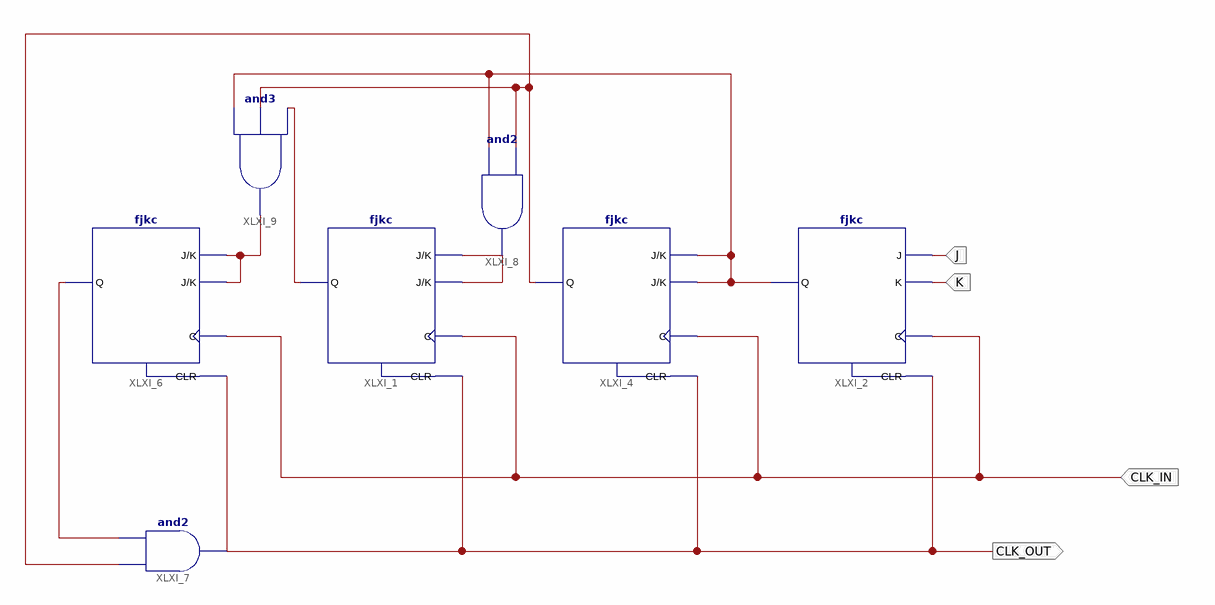
[diagram p0: schematic sheet 1]
// Xilinx ISE schematic Mod10Pulse.sch (spartan6) as structural Verilog: 7 symbols, 4 ports
module Mod10Pulse (
  input  K,
  input  J,
  input  CLK_IN,
  output CLK_OUT
);

  wire XLXN_13, XLXN_14, XLXN_18, XLXN_20, XLXN_23, XLXN_26;

  and XLXI_9 (XLXN_20, XLXN_18, XLXN_23, XLXN_26);
  and XLXI_8 (XLXN_13, XLXN_18, XLXN_23);
  and XLXI_7 (CLK_OUT, XLXN_23, XLXN_14);
  fjkc XLXI_4 (.C(CLK_IN), .CLR(CLK_OUT), .J(XLXN_18), .K(XLXN_18), .Q(XLXN_23));
  fjkc XLXI_6 (.C(CLK_IN), .CLR(CLK_OUT), .J(XLXN_20), .K(XLXN_20), .Q(XLXN_14));
  fjkc XLXI_2 (.C(CLK_IN), .CLR(CLK_OUT), .J(J), .K(K), .Q(XLXN_18));
  fjkc XLXI_1 (.C(CLK_IN), .CLR(CLK_OUT), .J(XLXN_13), .K(XLXN_13), .Q(XLXN_26));
endmodule
